# EAGLE schematic LightHouse (EAGLE 7.7.0)
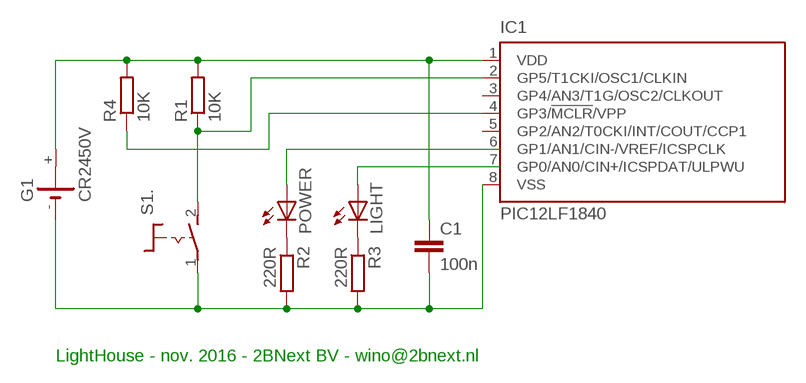
[diagram p0: schematic, sheet 1]

## Parts
C1  100n  C2,5-3  [C2.5-3]
G1  CR2450V  [CR2450V]
IC1  PIC12LF1840  PIC12F683P  [DIL8]
LIGHT  LED5MM  [LED5MM]
POWER  LED5MM  [LED5MM]
R1  10K  R-EU_0204/5  [0204/5]
R2  220R  R-EU_0204/5  [0204/5]
R3  220R  R-EU_0204/5  [0204/5]
R4  10K  R-EU_0204/5  [0204/5]
S1  MARQ6425  [MARQ6425]

## Nets
N$1: POWER.K(C) R2.1
N$2: LIGHT.K(C) R3.1
N$3: LIGHT.A
N$4: POWER.A
N$5: C1.1 G1.+ IC1.1(VDD) R1.2 R4.2
N$6: C1.2 G1.- IC1.8(VSS) R2.2 R3.2 S1.1(.:P)
N$7: IC1.2(GP5/T1CKI/OSC1/CLKIN) R1.1 S1.2(.:S)
N$8: IC1.4(GP3/!MCLR!/VPP) R4.1
Unconnected: G1.+@1(+) IC1.3(GP4/AN3/T1G/OSC2/CLKOUT) IC1.5(GP2/AN2/T0CKI/INT/COUT/CCP1) IC1.6(GP1/AN1/CIN-/VREF/ICSPCLK) IC1.7(GP0/AN0/CIN+/ICSPDAT/ULPWU) S1.A(LED:A) S1.K(LED:K)

## Notes on the sheet
- LightHouse - nov. 2016 - 2BNext BV - wino@2bnext.nl

## Library data of the parts
C1 = capacitor-wima:C: CAPACITOR naming: grid - package width
G1 = battery:CR2450V: LI BATTERY Varta
IC1 = microchip:PIC12F683: 8-Pin Flash-Based, 8-Bit CMOS Microcontrollers with nanoWatt Technology Source: http://ww1.microchip.com/downloads/en/DeviceDoc/41211D_.pdf; MF: MICROCHIP; MPN: PIC12F683-I/P; OC_FARNELL: 9759034; OC_NEWARK: 89H0442
LIGHT POWER = led:LED: LED OSRAM: - CHIPLED LG R971, LG N971, LY N971, LG Q971, LY Q971, LO R971, LY R971 LH N974, LH R974 LS Q976, LO Q976, LY Q976 LO Q996 - Hyper CHIPLED LW Q18S LB Q993, LB Q99A, LB R99A - SideLED LS A670, LO A670, LY A670, LG A670, LP A670 LB A673, LV A673, LT A673, LW A673 LH A674 LY A675 LS A676, LA A676, LO A676, LY A676, LW A676 LS A679, LY A679, LG A679 - Hyper Micro SIDELED® LS Y876, LA Y876, LO Y876, LY Y876 LT Y87S - SmartLED LW L88C, LW L88S LB L89C, LB L89S, LG L890 LS L89K, LO L89K, LY L89K LS L896, LA L896, LO L896, LY L896 - TOPLED LS T670, LO T670, LY T670, LG T670, LP T670 LSG T670, LSP T670, LSY T670, LOP T670, LYG T670 LG T671, LOG T671, LSG T671 LB T673, LV T673, LT T673, LW T673 LH T674 LS T676, LA T676, LO T676, LY T676, LB T676, LH T676, LSB T676, LW T676 LB T67C, LV T67C, LT T67C, LS T67K, LO T67K, LY T67K, LW E67C LS E67B, LA E67B, LO E67B, LY E67B, LB E67C, LV E67C, LT E67C LW T67C LS T679, LY T679, LG T679 LS T770, LO T770, LY T770, LG T770, LP T770 LB T773, LV T773, LT T773, LW T773 LH T774 LS E675, LA E675, LY E675, LS T675 LS T776, LA T776, LO T776, LY T776, LB T776 LHGB T686 LT T68C, LB T68C - Hyper Mini TOPLED® LB M676 - Mini TOPLED Santana® LG M470 LS M47K, LO M47K, LY M47K Source: http://www.osram.convergy.de LUXEON: - LUMILED® LXK2-PW12-R00, LXK2-PW12-S00, LXK2-PW14-U00, LXK2-PW14-V00 LXK2-PM12-R00, LXK2-PM12-S00, LXK2-PM14-U00 LXK2-PE12-Q00, LXK2-PE12-R00, LXK2-PE12-S00, LXK2-PE14-T00, LXK2-PE14-U00 LXK2-PB12-K00, LXK2-PB12-L00, LXK2-PB12-M00, LXK2-PB14-N00, LXK2-PB14-P00, LXK2-PB14-Q00 LXK2-PR12-L00, LXK2-PR12-M00, LXK2-PR14-Q00, LXK2-PR14-R00 LXK2-PD12-Q00, LXK2-PD12-R00, LXK2-PD12-S00 LXK2-PH12-R00, LXK2-PH12-S00 LXK2-PL12-P00, LXK2-PL12-Q00, LXK2-PL12-R00 Source: www.luxeon.com KINGBRIGHT: KA-3528ASYC Source: www.kingbright.com
R1-R4 = rcl:R-EU_: RESISTOR, European symbol
S1 = switch:MARQ6425: DIL SWITCH with LED, Marquardt